# EAGLE schematic BMS Layout rev2 (EAGLE 8.2.1)
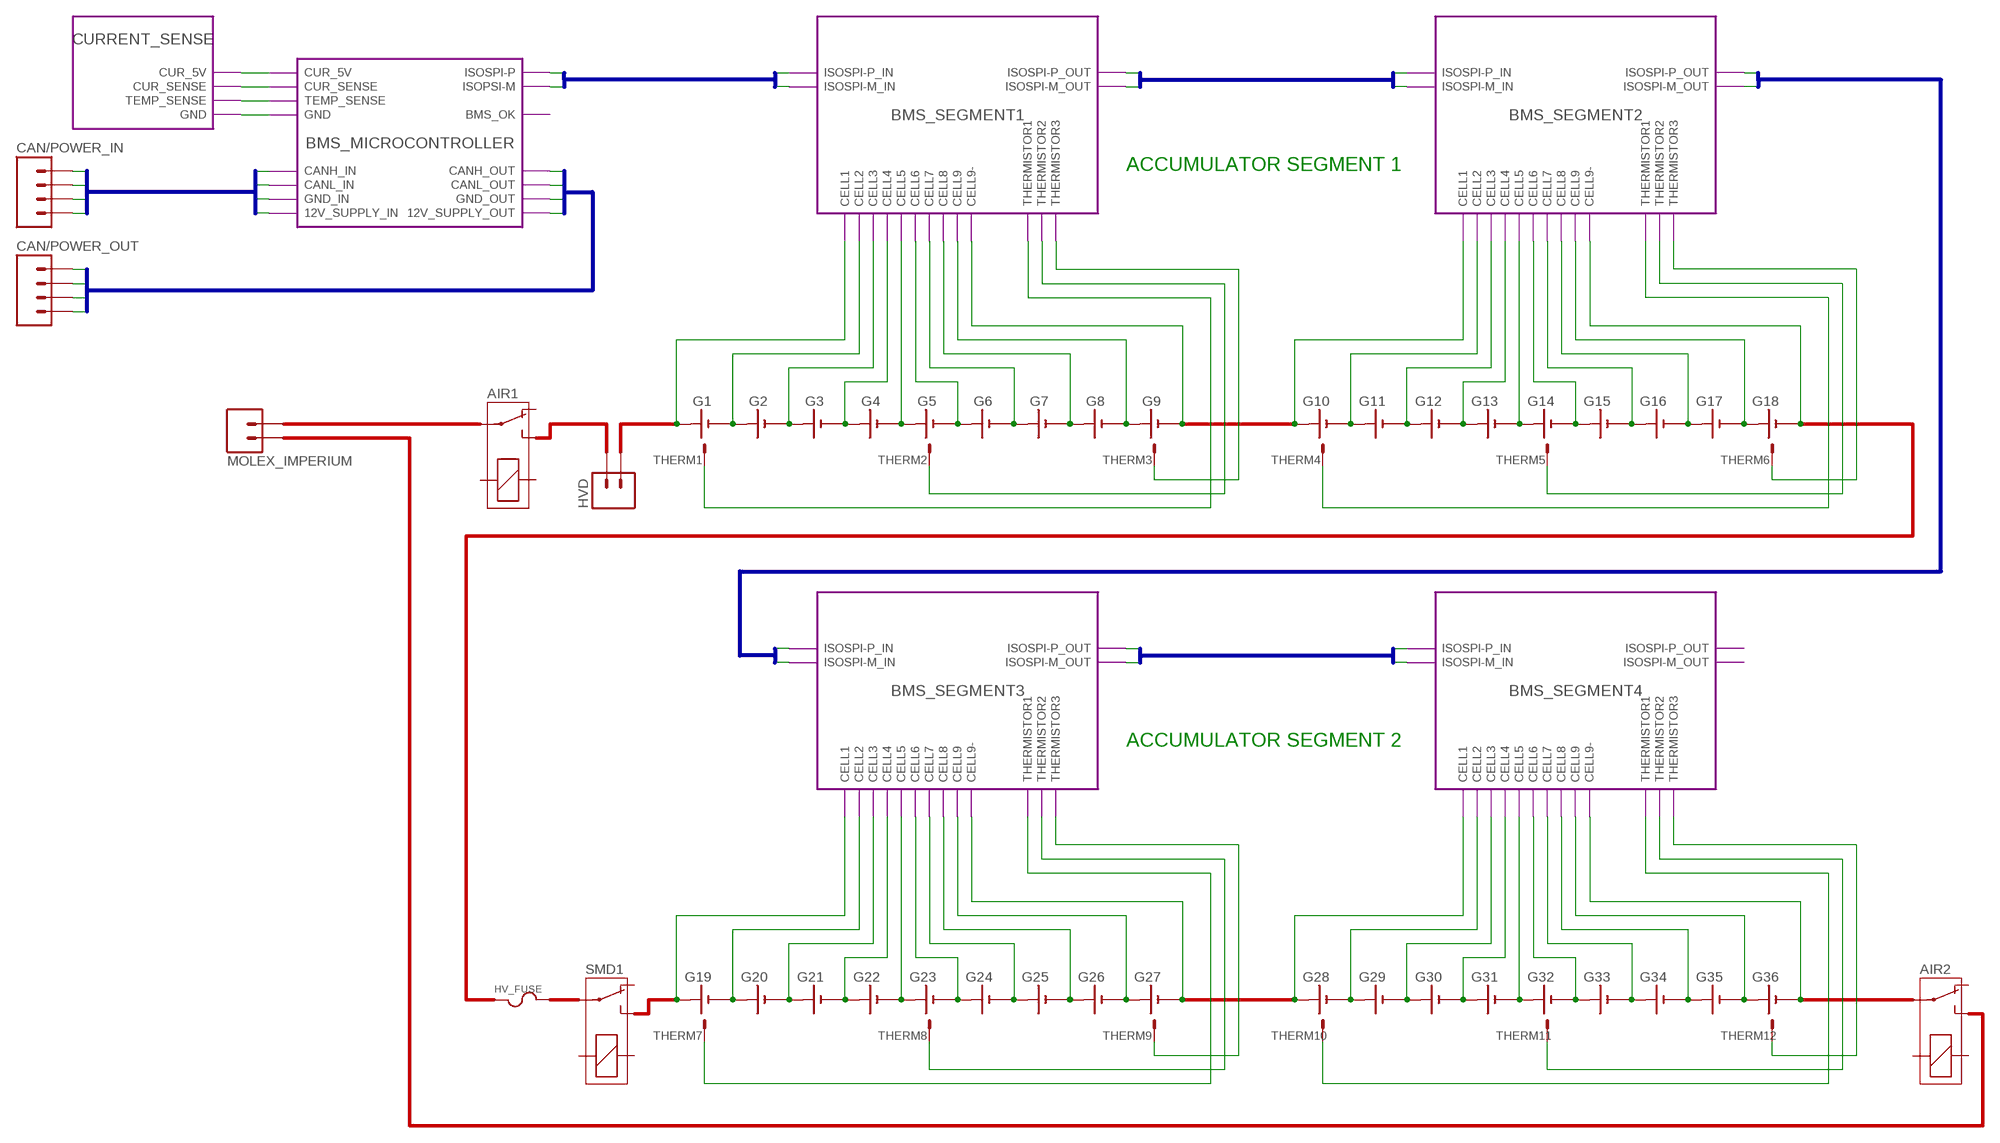
[diagram p0: schematic, sheet 1]

## Parts
AIR1  RELAY  (no package)
AIR2  RELAY  (no package)
CAN/POWER_IN  M04  (no package)
CAN/POWER_OUT  M04  (no package)
G1  BATTERY_1_CELL  (no package)
G2  BATTERY_1_CELL  (no package)
G3  BATTERY_1_CELL  (no package)
G4  BATTERY_1_CELL  (no package)
G5  BATTERY_1_CELL  (no package)
G6  BATTERY_1_CELL  (no package)
G7  BATTERY_1_CELL  (no package)
G8  BATTERY_1_CELL  (no package)
G9  BATTERY_1_CELL  (no package)
G10  BATTERY_1_CELL  (no package)
G11  BATTERY_1_CELL  (no package)
G12  BATTERY_1_CELL  (no package)
G13  BATTERY_1_CELL  (no package)
G14  BATTERY_1_CELL  (no package)
G15  BATTERY_1_CELL  (no package)
G16  BATTERY_1_CELL  (no package)
G17  BATTERY_1_CELL  (no package)
G18  BATTERY_1_CELL  (no package)
G19  BATTERY_1_CELL  (no package)
G20  BATTERY_1_CELL  (no package)
G21  BATTERY_1_CELL  (no package)
G22  BATTERY_1_CELL  (no package)
G23  BATTERY_1_CELL  (no package)
G24  BATTERY_1_CELL  (no package)
G25  BATTERY_1_CELL  (no package)
G26  BATTERY_1_CELL  (no package)
G27  BATTERY_1_CELL  (no package)
G28  BATTERY_1_CELL  (no package)
G29  BATTERY_1_CELL  (no package)
G30  BATTERY_1_CELL  (no package)
G31  BATTERY_1_CELL  (no package)
G32  BATTERY_1_CELL  (no package)
G33  BATTERY_1_CELL  (no package)
G34  BATTERY_1_CELL  (no package)
G35  BATTERY_1_CELL  (no package)
G36  BATTERY_1_CELL  (no package)
HV_FUSE  FUSE  (no package)
HVD  M02  (no package)
MOLEX_IMPERIUM  M02  (no package)
SMD1  RELAY  (no package)
THERM1  THERMISTOR  (no package)
THERM2  THERMISTOR  (no package)
THERM3  THERMISTOR  (no package)
THERM4  THERMISTOR  (no package)
THERM5  THERMISTOR  (no package)
THERM6  THERMISTOR  (no package)
THERM7  THERMISTOR  (no package)
THERM8  THERMISTOR  (no package)
THERM9  THERMISTOR  (no package)
THERM10  THERMISTOR  (no package)
THERM11  THERMISTOR  (no package)
THERM12  THERMISTOR  (no package)

## Module instances
BMS_SEGMENT1 = BMS_SEGMENT
BMS_SEGMENT2 = BMS_SEGMENT
BMS_SEGMENT3 = BMS_SEGMENT
BMS_SEGMENT4 = BMS_SEGMENT
BMS_MICROCONTROLLER = BMS_MICROCONTROLLER
CURRENT_SENSE = CURRENT_SENSE

## Nets
B$1: port BMS_SEGMENT1.ISOSPI-P_OUT BMS_SEGMENT1.ISOSPI-M_OUT BMS_SEGMENT2.ISOSPI-P_OUT BMS_SEGMENT2.ISOSPI-M_OUT BMS_SEGMENT3.ISOSPI-P_OUT BMS_SEGMENT3.ISOSPI-M_OUT
B$2: port BMS_SEGMENT2.ISOSPI-P_IN BMS_SEGMENT2.ISOSPI-M_IN BMS_SEGMENT3.ISOSPI-P_IN BMS_SEGMENT3.ISOSPI-M_IN BMS_SEGMENT4.ISOSPI-P_IN BMS_SEGMENT4.ISOSPI-M_IN
B$3: port BMS_MICROCONTROLLER.ISOSPI-P BMS_MICROCONTROLLER.ISOPSI-M
B$4: port BMS_SEGMENT1.ISOSPI-P_IN BMS_SEGMENT1.ISOSPI-M_IN
B$5: port BMS_MICROCONTROLLER.CANH_IN BMS_MICROCONTROLLER.CANL_IN BMS_MICROCONTROLLER.GND_IN BMS_MICROCONTROLLER.12V_SUPPLY_IN
B$6: port BMS_MICROCONTROLLER.CANH_OUT BMS_MICROCONTROLLER.CANL_OUT BMS_MICROCONTROLLER.GND_OUT BMS_MICROCONTROLLER.12V_SUPPLY_OUT
B$7: CAN/POWER_IN.1 CAN/POWER_IN.2 CAN/POWER_IN.3 CAN/POWER_IN.4
B$8: CAN/POWER_OUT.1 CAN/POWER_OUT.2 CAN/POWER_OUT.3 CAN/POWER_OUT.4
N$1: port BMS_MICROCONTROLLER.CUR_5V CURRENT_SENSE.CUR_5V
N$2: port BMS_MICROCONTROLLER.CUR_SENSE CURRENT_SENSE.CUR_SENSE
N$3: port BMS_MICROCONTROLLER.TEMP_SENSE CURRENT_SENSE.TEMP_SENSE
N$4: port BMS_MICROCONTROLLER.GND CURRENT_SENSE.GND
N$7: G28.+ ; port BMS_SEGMENT4.CELL1
N$8: G36.- ; port BMS_SEGMENT4.CELL9-
N$11: G10.+ ; port BMS_SEGMENT2.CELL1
N$15: G1.+ ; port BMS_SEGMENT1.CELL1
N$16: G10.- G11.+ ; port BMS_SEGMENT2.CELL2
N$17: G11.- G12.+ ; port BMS_SEGMENT2.CELL3
N$18: G12.- G13.+ ; port BMS_SEGMENT2.CELL4
N$19: G1.- G2.+ ; port BMS_SEGMENT1.CELL2
N$20: G13.- G14.+ ; port BMS_SEGMENT2.CELL5
N$21: G2.- G3.+ ; port BMS_SEGMENT1.CELL3
N$22: G14.- G15.+ ; port BMS_SEGMENT2.CELL6
N$23: G15.- G16.+ ; port BMS_SEGMENT2.CELL7
N$24: G16.- G17.+ ; port BMS_SEGMENT2.CELL8
N$25: G17.- G18.+ ; port BMS_SEGMENT2.CELL9
N$26: G3.- G4.+ ; port BMS_SEGMENT1.CELL4
N$27: G18.- ; port BMS_SEGMENT2.CELL9-
N$28: G28.- G29.+ ; port BMS_SEGMENT4.CELL2
N$29: G19.- G20.+ ; port BMS_SEGMENT3.CELL2
N$30: G20.- G21.+ ; port BMS_SEGMENT3.CELL3
N$31: G21.- G22.+ ; port BMS_SEGMENT3.CELL4
N$32: G22.- G23.+ ; port BMS_SEGMENT3.CELL5
N$33: G4.- G5.+ ; port BMS_SEGMENT1.CELL5
N$34: G23.- G24.+ ; port BMS_SEGMENT3.CELL6
N$35: G24.- G25.+ ; port BMS_SEGMENT3.CELL7
N$36: G25.- G26.+ ; port BMS_SEGMENT3.CELL8
N$37: G5.- G6.+ ; port BMS_SEGMENT1.CELL6
N$38: G26.- G27.+ ; port BMS_SEGMENT3.CELL9
N$39: G27.- ; port BMS_SEGMENT3.CELL9-
N$40: G19.+ ; port BMS_SEGMENT3.CELL1
N$41: G6.- G7.+ ; port BMS_SEGMENT1.CELL7
N$42: G29.- G30.+ ; port BMS_SEGMENT4.CELL3
N$43: G30.- G31.+ ; port BMS_SEGMENT4.CELL4
N$44: G7.- G8.+ ; port BMS_SEGMENT1.CELL8
N$45: G31.- G32.+ ; port BMS_SEGMENT4.CELL5
N$46: G32.- G33.+ ; port BMS_SEGMENT4.CELL6
N$47: G8.- G9.+ ; port BMS_SEGMENT1.CELL9
N$48: G33.- G34.+ ; port BMS_SEGMENT4.CELL7
N$49: G34.- G35.+ ; port BMS_SEGMENT4.CELL8
N$50: G35.- G36.+ ; port BMS_SEGMENT4.CELL9
N$54: G9.- ; port BMS_SEGMENT1.CELL9-
N$73: THERM1.S ; port BMS_SEGMENT1.THERMISTOR1
N$93: THERM2.S ; port BMS_SEGMENT1.THERMISTOR2
N$95: THERM3.S ; port BMS_SEGMENT1.THERMISTOR3
N$96: THERM4.S ; port BMS_SEGMENT2.THERMISTOR1
N$97: THERM5.S ; port BMS_SEGMENT2.THERMISTOR2
N$98: THERM6.S ; port BMS_SEGMENT2.THERMISTOR3
N$99: THERM7.S ; port BMS_SEGMENT3.THERMISTOR1
N$100: THERM8.S ; port BMS_SEGMENT3.THERMISTOR2
N$101: THERM9.S ; port BMS_SEGMENT3.THERMISTOR3
N$102: THERM10.S ; port BMS_SEGMENT4.THERMISTOR1
N$103: THERM11.S ; port BMS_SEGMENT4.THERMISTOR2
N$104: THERM12.S ; port BMS_SEGMENT4.THERMISTOR3
Unconnected: AIR1.1 AIR1.2 AIR1.O AIR1.P AIR1.S AIR2.1 AIR2.2 AIR2.O AIR2.P AIR2.S HV_FUSE.1 HV_FUSE.2 HVD.1 HVD.2 MOLEX_IMPERIUM.1 MOLEX_IMPERIUM.2 SMD1.1 SMD1.2 SMD1.O SMD1.P SMD1.S

## Buses
B$1
B$2
B$4
B$5
B$6
B$7
B$8

## Notes on the sheet
- ACCUMULATOR SEGMENT 1
- ACCUMULATOR SEGMENT 2

## Library data of the parts
AIR1 AIR2 SMD1 = HyTechSymbols:RELAY: RELAY 1 x switch
CAN/POWER_IN CAN/POWER_OUT = HyTechSymbols:M04: Generic 4-pin connector
G1-G36 = HyTechSymbols:BATTERY_1_CELL: Generic 1-cell battery Source: Sonnenschein
HV_FUSE = HyTechSymbols:FUSE: Generic Fuse
HVD MOLEX_IMPERIUM = HyTechSymbols:M02: Generic 2-pin connector
THERM1-THERM12 = HyTechSymbols:THERMISTOR

## Module BMS_SEGMENT
Ports: CELL1(in) CELL2(in) CELL3(in) CELL4(in) CELL5(in) CELL6(in) CELL7(in) CELL8(in) CELL9(in) ISOSPI-P_IN(in) ISOSPI-M_IN(in) ISOSPI-P_OUT(out) ISOSPI-M_OUT(out) THERMISTOR1(in) THERMISTOR2(in) THERMISTOR3(in) CELL9-(in)

### Library data of the parts

## Module BMS_MICROCONTROLLER
Ports: ISOSPI-P(out) ISOPSI-M(out) 12V_SUPPLY_IN(in) GND_IN(in) CANL_IN(in) CANH_IN(in) 12V_SUPPLY_OUT(out) GND_OUT(out) CANL_OUT(out) CANH_OUT(out) BMS_OK(out) CUR_5V(out) CUR_SENSE(in) TEMP_SENSE(in) GND(in)

### Library data of the parts

## Module CURRENT_SENSE
Ports: CUR_5V(in) CUR_SENSE(out) TEMP_SENSE(out) GND(out)

### Library data of the parts